# EAGLE schematic LedBricksPower (EAGLE 9.6.2)
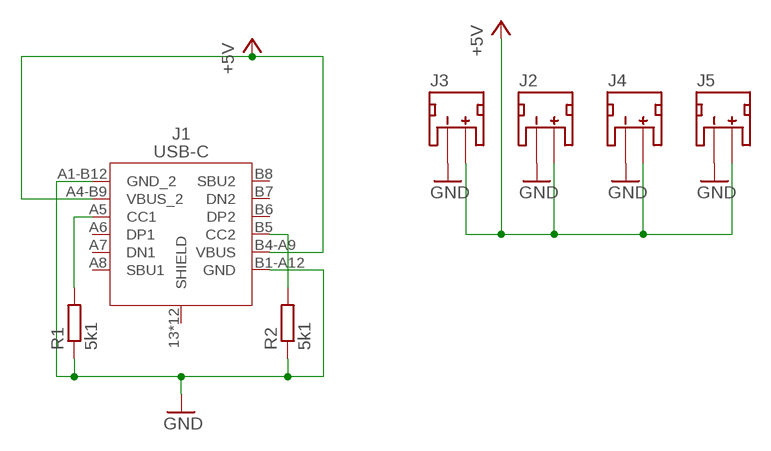
[diagram p0: schematic, sheet 1]

## Parts
J1  USB-C  [USB-C]
J2  JST_2MM_MALE  [JST-2-SMD]
J3  JST_2MM_MALE  [JST-2-SMD]
J4  JST_2MM_MALE  [JST-2-SMD]
J5  JST_2MM_MALE  [JST-2-SMD]
R1  5k1  R-EU_R0603  [R0603]
R2  5k1  R-EU_R0603  [R0603]

## Nets
+5V: J1.A4-B9(VBUS_2) J1.B4-A9(VBUS) J2.2(+) J3.2(+) J4.2(+) J5.2(+)
GND: J1.A1-B12(GND_2) J1.B1-A12(GND) J2.1(-) J3.1(-) J4.1(-) J5.1(-) R1.1 R2.1
N$2: J1.A5(CC1) R1.2
N$6: J1.B5(CC2) R2.2
Unconnected: J1.13(SHIELD) J1.14(SHIELD) J1.15(SHIELD) J1.16(SHIELD) J1.A6(DP1) J1.A7(DN1) J1.A8(SBU1) J1.B6(DP2) J1.B7(DN2) J1.B8(SBU2) J1.S_1_H1(SHIELD) J1.S_1_H2(SHIELD) J1.S_2_H1(SHIELD) J1.S_2_H2(SHIELD) J1.S_3_H1(SHIELD) J1.S_3_H2(SHIELD) J1.S_4_H1(SHIELD) J1.S_4_H2(SHIELD) J2.NC1(PAD1) J2.NC2(PAD2) J3.NC1(PAD1) J3.NC2(PAD2) J4.NC1(PAD1) J4.NC2(PAD2) J5.NC1(PAD1) J5.NC2(PAD2)

## Library data of the parts
J1 = BASTL_CONNECTORS:USB-C: DigiKey: USB4105-GF-A LCSC: C165948
J2-J5 = SparkFun-Connectors:JST_2MM_MALE: JST 2MM MALE RA CONNECTOR Two pin, compact surface mount connector. Commonly used as a battery input connection point. We really like the solid locking feeling and high current rating on these small connectors. We use these all the time as battery connectors. Mates to single-cell LiPo batteries. Here is the connector we sell at SparkFun: JST Right Angle Connector - White <https://www.sparkfun.com/products/8612> (PRT-08612) Datasheet <http://www.sparkfun.com/datasheets/Prototyping/Connectors/JST-Horizontal.pdf> It was used on these SparkFun products: SparkFun MOSFET Power Controller <https://www.sparkfun.com/products/11214> (PRT-11214) SparkFun Battery Babysitter - LiPo Battery Manager <https://www.sparkfun.com/products/13777> (PRT-13777) And many, many others that required a lipo battery connection.; PROD_ID: CONN-11443; SF_ID: PRT-08612
R1 R2 = resistor:R-EU_: RESISTOR, European symbol